# Altium schematic sheet CAN.SchDoc
size A4; SheetNumber: 4; SheetTotal: 14
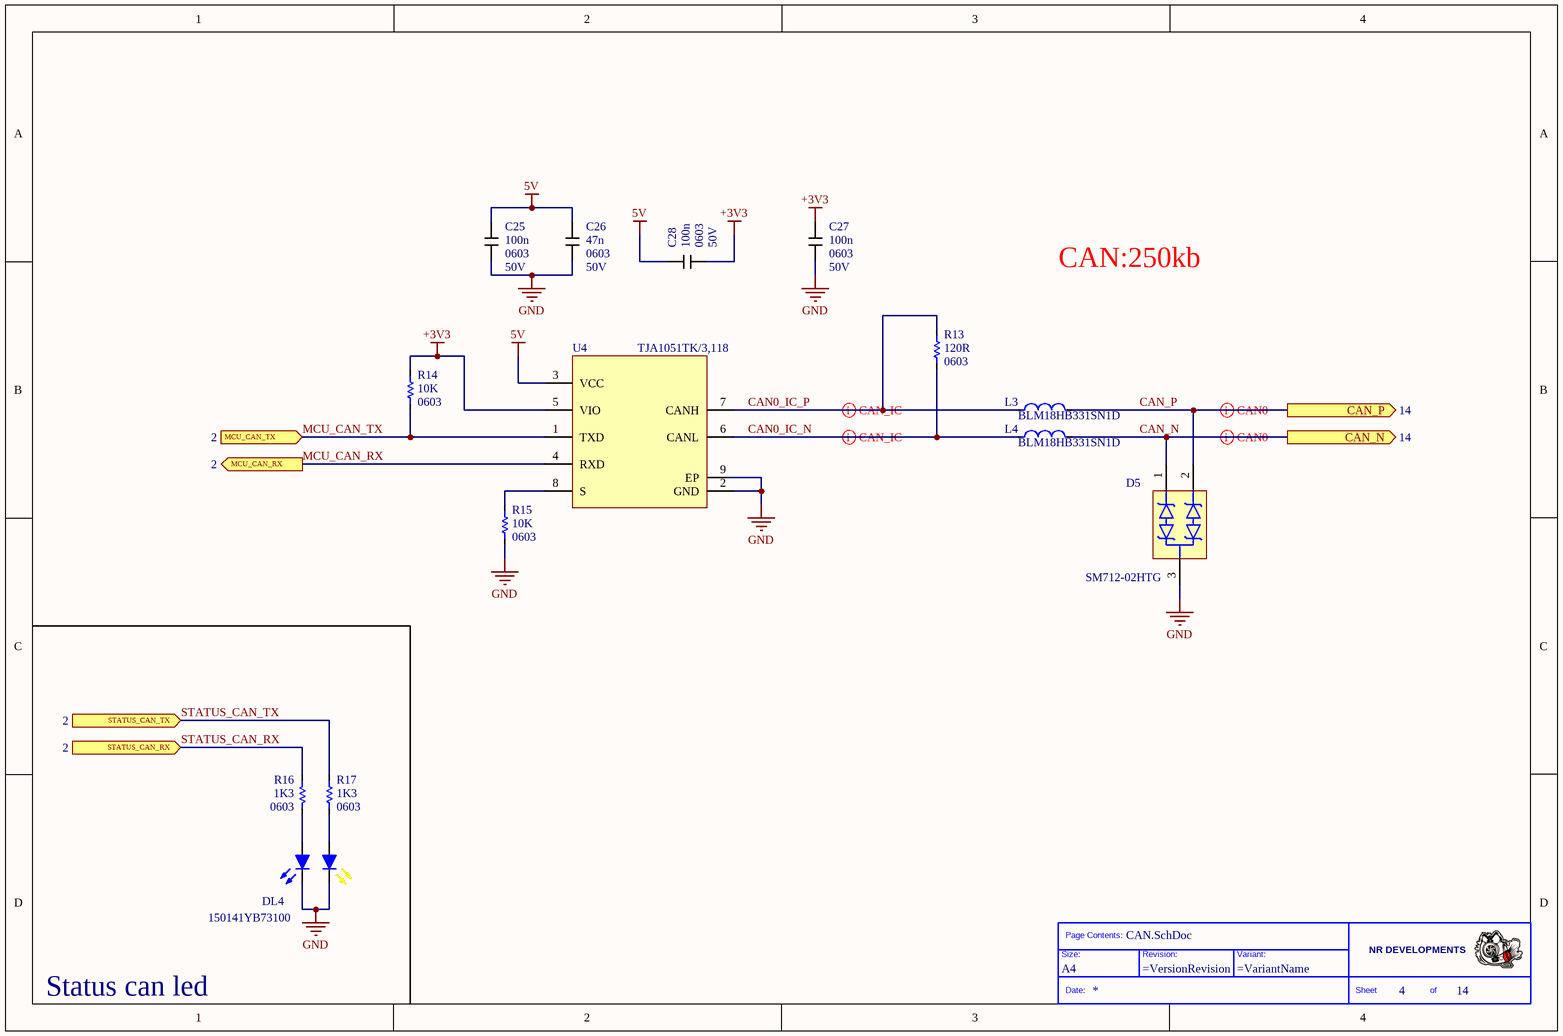
[diagram p0: CAN.SchDoc]

## Parts
*  Size: A4  (hidden comment: Title_Block)  (graphical)
C25  value 100n  Case: 0603  Voltage: 50V  [CAPC1608X09M]  (hidden comment: CAP)
C26  value 47n  Case: 0603  Voltage: 50V  [CAPC1608X09M]  (hidden comment: CAP)
C27  value 100n  Case: 0603  Voltage: 50V  [CAPC1608X09M]  (hidden comment: CAP)
C28  value 100n  Case: 0603  Voltage: 50V  [CAPC1608X09M]  (hidden comment: CAP)
D5  value SM712-02HTG  [SOT95P240X120-3N]  (hidden comment: ESD_Diode)
DL4  value 150141YB73100  [WURTH-SBTW_3528]  (hidden comment: LED_Yellow_Blue)
L3  value BLM18HB331SN1D  [INDC1608X09N]  (hidden comment: IND)
L4  value BLM18HB331SN1D  [INDC1608X09N]  (hidden comment: IND)
R13  value 120R  Case: 0603  [RESC1608X06M]  (hidden comment: Res)
R14  value 10K  Case: 0603  [RESC1608X06M]  (hidden comment: Res)
R15  value 10K  Case: 0603  [RESC1608X06M]  (hidden comment: Res)
R16  value 1K3  Case: 0603  [RESC1608X06M]  (hidden comment: Res)
R17  value 1K3  Case: 0603  [RESC1608X06M]  (hidden comment: Res)
U4  TJA1051TK/3,118  [SON65P300X300X100-9N-D]

## Ports
CAN_N (out, see 14), CAN_P (out, see 14), MCU_CAN_RX (out, see 2), MCU_CAN_TX (in, see 2), STATUS_CAN_RX (in, see 2), STATUS_CAN_TX (in, see 2)

## Nets
5V: C25.1 C26.1 C28.1 U4.3(VCC)
+3V3: C27.1 C28.2 R14.2 U4.5(VIO)
GND: C25.2 C26.2 C27.2 D5.3 DL4.C1 DL4.C2 R15.1 U4.2(GND) U4.9(EP)
CAN0_IC_N: L4.1 R13.1 U4.6(CANL)
CAN0_IC_P: L3.1 R13.2 U4.7(CANH)
CAN_N: D5.1 L4.2 ; port CAN_N
CAN_P: D5.2 L3.2 ; port CAN_P
MCU_CAN_RX: U4.4(RXD) ; port MCU_CAN_RX
MCU_CAN_TX: R14.1 U4.1(TXD) ; port MCU_CAN_TX
STATUS_CAN_RX: R16.2 ; port STATUS_CAN_RX
STATUS_CAN_TX: R17.2 ; port STATUS_CAN_TX
NetDL4_A1: DL4.A1 R17.1
NetDL4_A2: DL4.A2 R16.1
NetR15_2: R15.2 U4.8(S)

## Layout directives
differential pair: CAN0_IC_N, CAN0_IC_P, CAN_N, CAN_P

## Notes on the sheet
- CAN:250kb
- Status can led
- (in symbol Title_Block) Page Contents:; NR DEVELOPMENTS; Size:; Revision:; Variant:; Date:; Sheet; of

## Library data of the parts
C25 C27 C28 = CAP: Manufacturer: KEMET; PartNumber: C0603C104K5RACTU
C26 = CAP: Manufacturer: YAGEO; PartNumber: CC0603KRX7R9BB473
D5 = SM712-02HTG: ESD Diode bid; Manufacturer: Littelfuse; Case: SOT23-3; PartNumber: SM712-02HTG
DL4 = LED_Yellow_Blue: Led Yellow - Blue 3528; Manufacturer: Wurth; PartNumber: 150141YB73100; Case: 3528
L3 L4 = IND: Manufacturer: Murata; Case: 0603; PartNumber: BLM18HB331SN1D
R13 = Resistor: Manufacturer: Vishay; PartNumber: CRCW0603120RFKEA
R14 R15 = Resistor: Manufacturer: YAGEO; PartNumber: AC0603FR-0710KL
R16 R17 = Resistor: Manufacturer: Vishay; PartNumber: RC0603FR-071K3L
U4 = TJA1051TK/3: CAN HIGH-SPEED CAN TRANSCEIVER 3.3V / 5V Pin VIO; Manufacturer: NXP Semiconductors; Value: TJA1051TK/3,118; Case: HVSON-8; PartNumber: TJA1051TK/3,118